# EasyEDA schematic SCH_Wiring-harness-For-Activa_2025-07-03.json
TITLE: Sheet_1; REV: 1.0; Date: 2025-04-04; Sheet: 1/1; Drawn By: raajeshponnusamy; Company: Your Company
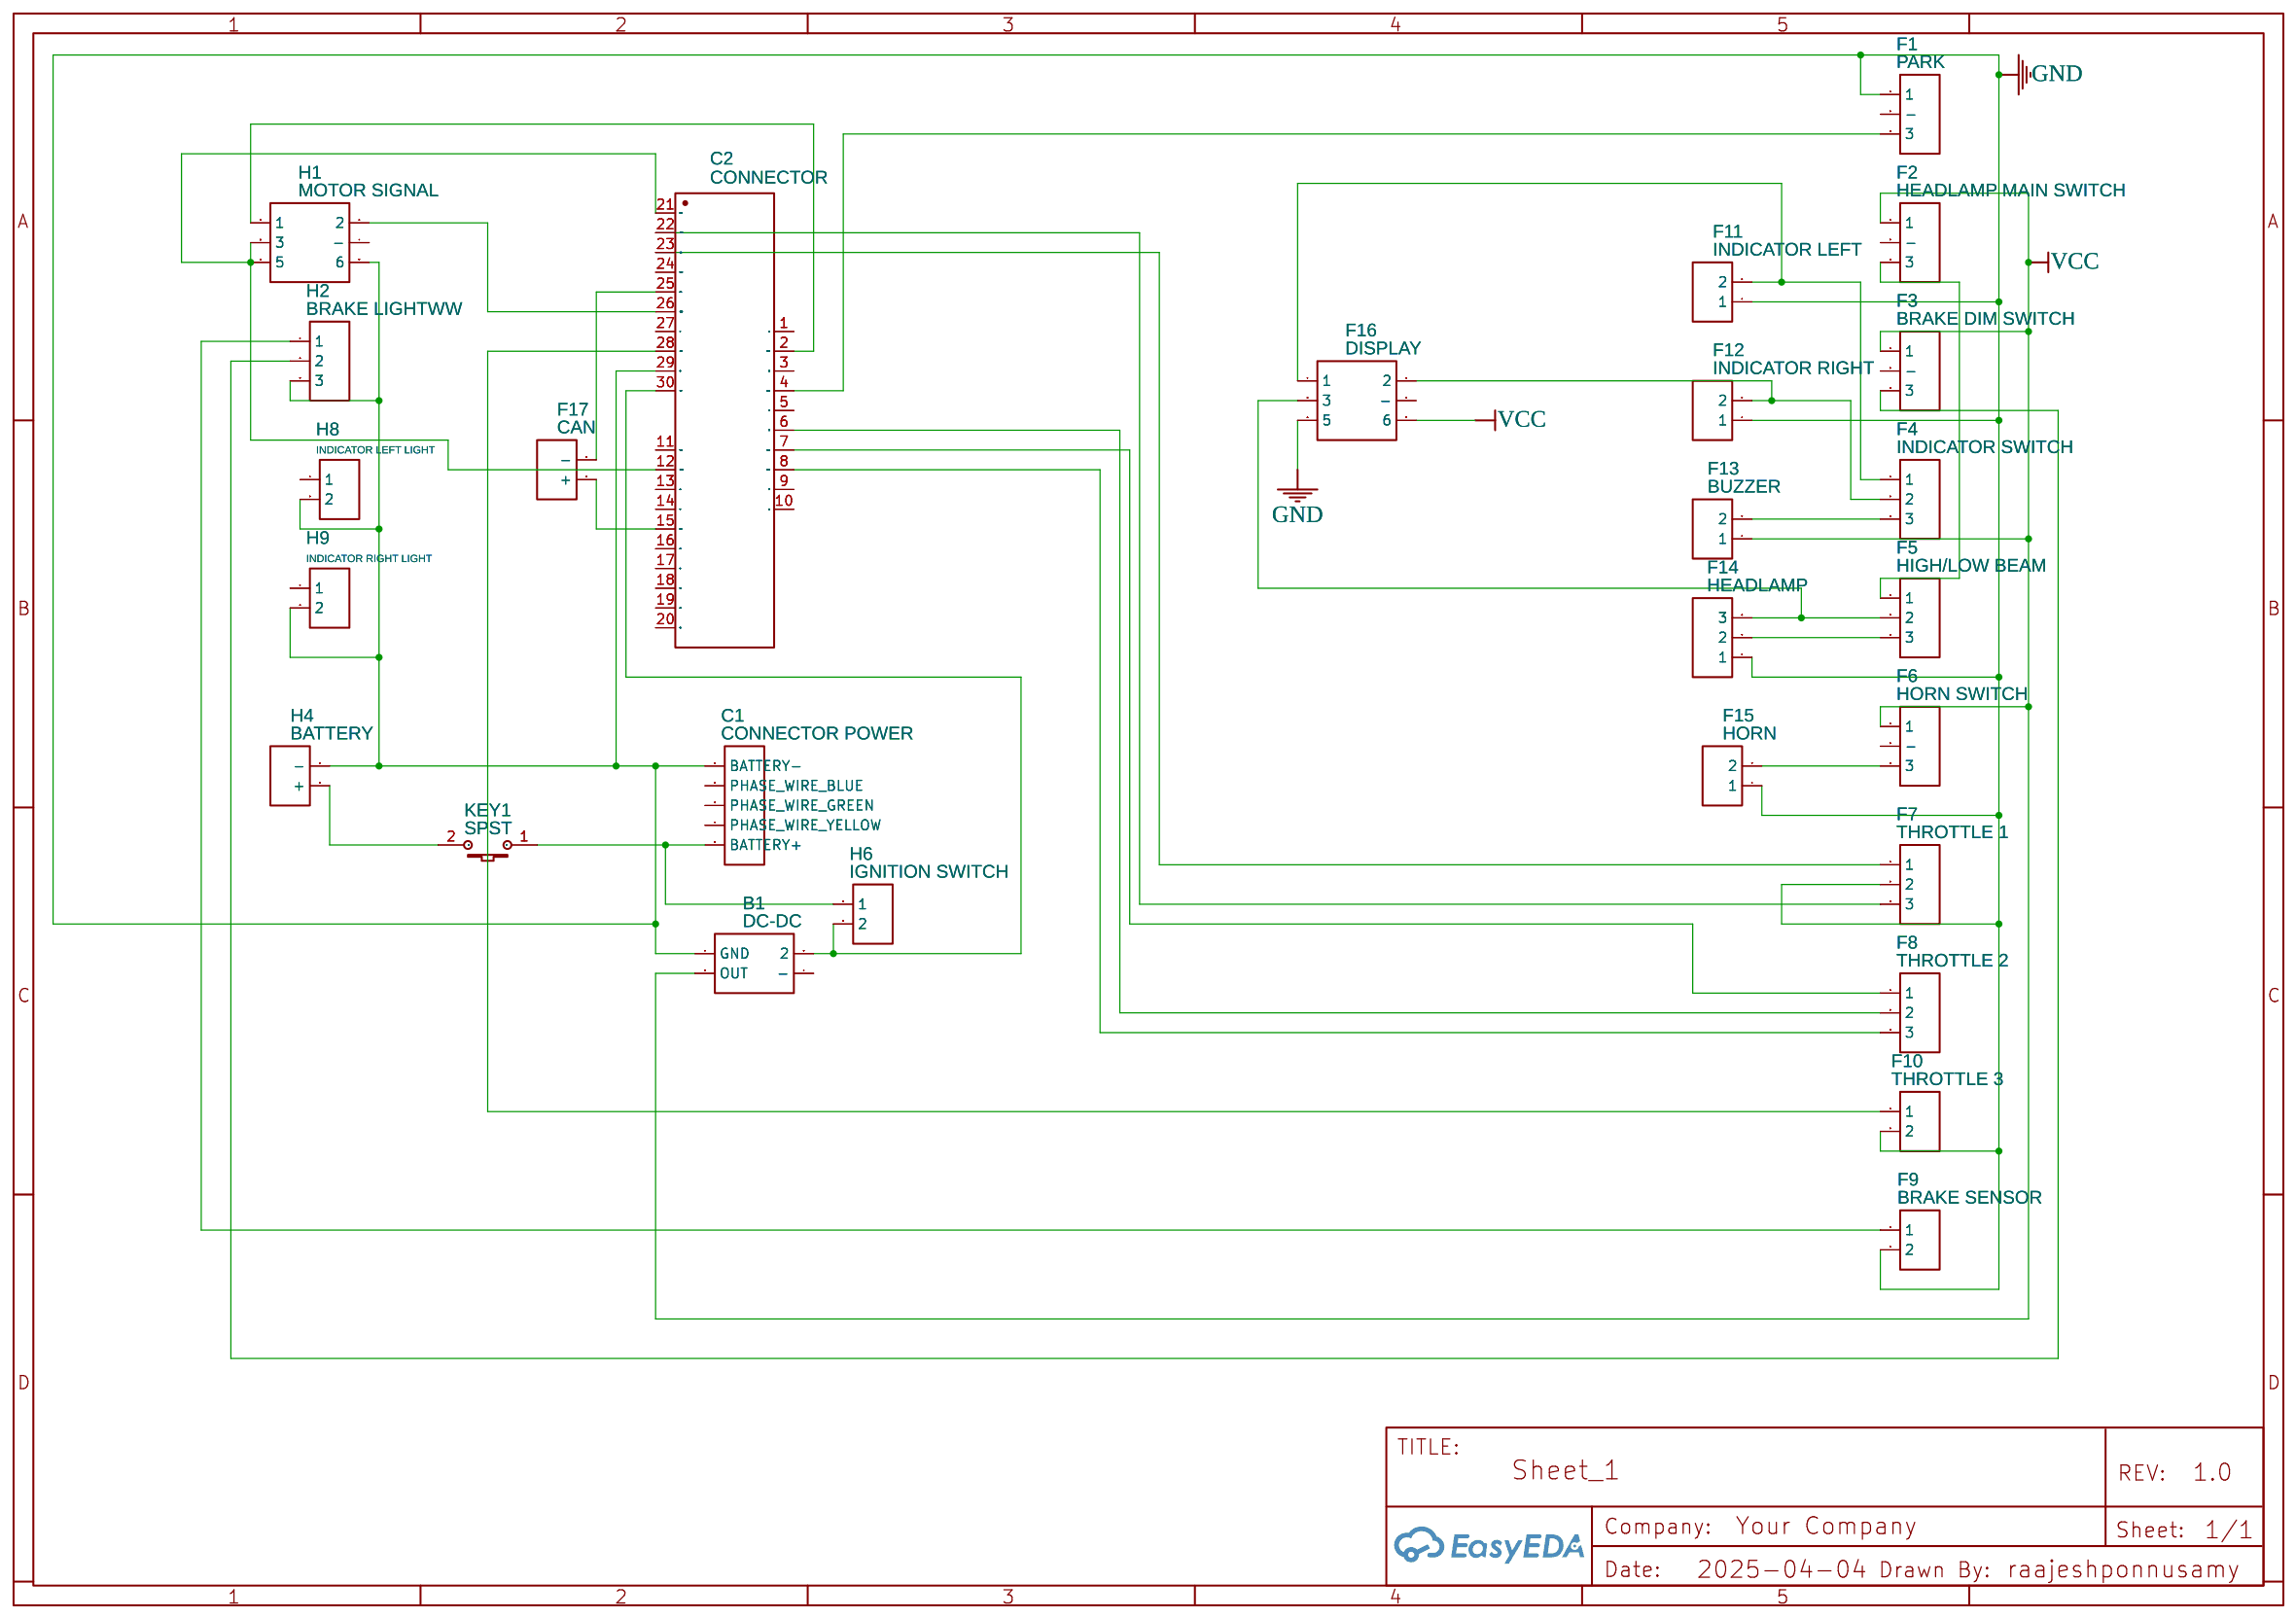
[diagram p0: schematic sheet]

## Parts
B1  DC-DC  [HDR-F-2.54_2X2]
C1  CONNECTOR POWER  [HDR-F-2.54_1X5]
C2  CONNECTOR  [CONN-TH_41612-R]
F1  PARK  [HDR-F-2.54_1X3]
F2  HEADLAMP MAIN SWITCH  [HDR-F-2.54_1X3]
F3  BRAKE DIM SWITCH  [HDR-F-2.54_1X3]
F4  INDICATOR SWITCH  [HDR-F-2.54_1X3]
F5  HIGH/LOW BEAM  [HDR-F-2.54_1X3]
F6  HORN SWITCH  [HDR-F-2.54_1X3]
F7  THROTTLE 1  [HDR-F-2.54_1X3]
F8  THROTTLE 2  [HDR-F-2.54_1X3]
F9  BRAKE SENSOR  [HDR-F-2.54_1X2]
F10  THROTTLE 3  [HDR-F-2.54_1X2]
F11  INDICATOR LEFT  [HDR-F-2.54_1X2]
F12  INDICATOR RIGHT  [HDR-F-2.54_1X2]
F13  BUZZER  [HDR-F-2.54_1X2]
F14  HEADLAMP  [HDR-F-2.54_1X3]
F15  HORN  [HDR-F-2.54_1X2]
F16  DISPLAY  [HDR-F-2.54_2X3]
F17  CAN  [HDR-F-2.54_1X2]
H1  MOTOR SIGNAL  [HDR-F-2.54_2X3]
H2  BRAKE LIGHTWW  [HDR-F-2.54_1X3]
H4  BATTERY  [HDR-F-2.54_1X2]
H6  IGNITION SWITCH  [HDR-F-2.54_1X2]
H8  INDICATOR LEFT LIGHT  [HDR-F-2.54_1X2]
H9  INDICATOR RIGHT LIGHT  [HDR-F-2.54_1X2]
KEY1  SPST  [KEY-SMD_2P-L6.2-W3.6-LS8.0]

## Library data of the parts
B1 = HDR-F-2.54_2x2: Supplier Part: C239342; Supplier: LCSC; Contributor: LCEDA_Lib
C1 = HDR-F-2.54_1x5: Supplier Part: C50950; Supplier: LCSC; Contributor: LCEDA_Lib
C2 = 41612-R(HE 11): Supplier: LCSC; Supplier Part: C9900135865; Manufacturer: null; Contributor: lcsc
F1-F8 F14 H2 = HDR-F-2.54_1x3: Supplier Part: C146690; Supplier: LCSC; Contributor: LCEDA_Lib
F9-F13 F15 F17 H4 H6 H8 H9 = HDR-F-2.54_1x2: Supplier Part: C49661; Supplier: LCSC; Contributor: LCEDA_Lib
F16 H1 = HDR-F-2.54_2x3: Supplier Part: C65114; Supplier: LCSC; Contributor: LCEDA_Lib
KEY1 = K2-3.6×6.1_SMD: Supplier Part: C118141; Supplier: LCSC; Manufacturer Part: K2-1107ST-A4SW-06; Contributor: LCEDA_Lib; 制造商: 韩国韩荣

## Nets
GND: B1.1(GND) C1.1(BATTERY-) C2.29(GUI) F1.1 F7.2 F9.2 F10.2 F11.1 F12.1 F14.1 F15.1 F16.5 H1.6 H2.3 H4.2(-) H8.2 H9.2
VCC: B1.3(OUT) F2.1 F3.1 F6.1 F13.1 F16.6
Net-(B1-2): B1.2 C2.30(ANTITHEFT) H6.2
Net-(C1-5): C1.5(BATTERY+) H6.1 KEY1.1
Net-(C2-2): C2.2(LOW GEAR INPUT) H1.1
Net-(C2-4): C2.4(HALL SENSOR 5V) F1.3
Net-(C2-6): C2.6(C6) F8.2
Net-(C2-7): C2.7(ANTITHEFT GND) F8.1
Net-(C2-8): C2.8(REVERSE INPUT) F8.3
Net-(C2-12): C2.12(HALL SENSOR B) C2.21(BRAKE LOW) H1.3 H1.5
Net-(C2-15): C2.15(CAN HIGH) F17.1(+)
Net-(C2-22): C2.22(HALL SENSOR C) F7.3
Net-(C2-23): C2.23(RX/485B) F7.1
Net-(C2-25): C2.25(CAN LOW) F17.2(-)
Net-(C2-26): C2.26(THROTTLE GND) H1.2
Net-(C2-28): C2.28(THROTTLE 5V) F10.1
Net-(F2-3): F2.3 F5.1
Net-(F3-3): F3.3 H2.2
Net-(F4-1): F4.1 F11.2 F16.1
Net-(F4-2): F4.2 F12.2 F16.2
Net-(F4-3): F4.3 F13.2
Net-(F5-2): F5.2 F14.3 F16.3
Net-(F5-3): F5.3 F14.2
Net-(F6-3): F6.3 F15.2
Net-(F9-1): F9.1 H2.1
Net-(H4-1): H4.1(+) KEY1.2

Not connected (* = marked no-connect by the designer): B1 4(-); C1 2(PHASE WIRE BLUE) 3(PHASE WIRE GREEN) 4(PHASE WIRE YELLOW); C2 1(C1) 3(C3) 5(C5) 9(C9) 10(C10) 11(BRAKE HIGH) 13(B3) 14(B4) 16(B6) 17(B7) 18(B8) 19(B9) 20(B10) 24(RESERVE INPUT) 27(A7); F1 2(-); F2 2(-); F3 2(-); F6 2(-); F16 4(-); H1 4(-); H8 1; H9 1
